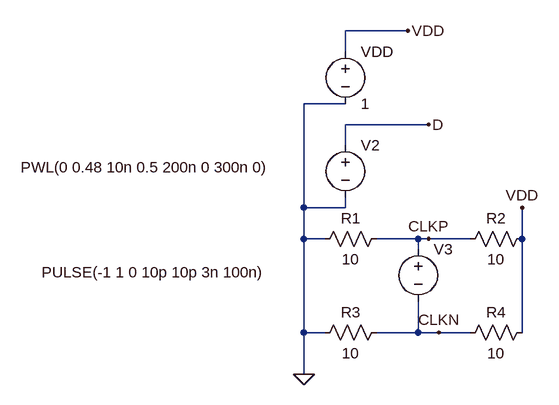
[diagram p0: schematic MetaS_ltspice_sim_2.asc]
MetaS_ltspice_sim_2.asc, the LTspice schematic file:
Version 4
SHEET 1 880 812
WIRE 0 0 -96 0
WIRE -96 32 -96 0
WIRE -96 112 -160 112
WIRE 32 144 -96 144
WIRE -96 176 -96 144
WIRE -160 272 -160 112
WIRE -96 272 -96 256
WIRE -96 272 -160 272
WIRE -160 320 -160 272
WIRE -128 320 -160 320
WIRE 16 320 -48 320
WIRE 32 320 16 320
WIRE 96 320 32 320
WIRE 176 320 176 272
WIRE 16 336 16 320
WIRE -160 464 -160 320
WIRE -128 464 -160 464
WIRE 16 464 16 416
WIRE 16 464 -48 464
WIRE 48 464 16 464
WIRE 96 464 48 464
WIRE 176 464 176 320
WIRE -160 528 -160 464
FLAG -160 528 0
FLAG 0 0 VDD
FLAG 32 144 D
FLAG 176 272 VDD
FLAG 32 320 CLKP
FLAG 48 464 CLKN
SYMBOL voltage -96 16 R0
WINDOW 123 0 0 Left 0
WINDOW 39 0 0 Left 0
SYMATTR InstName VDD
SYMATTR Value 1
SYMBOL voltage -96 160 R0
WINDOW 3 -500 50 Left 2
WINDOW 123 0 0 Left 0
WINDOW 39 0 0 Left 0
SYMATTR InstName V2
SYMATTR Value PWL(0 0.48 10n 0.5 200n 0 300n 0)
SYMBOL voltage 16 320 R0
WINDOW 3 -580 51 Left 2
WINDOW 123 0 0 Left 0
WINDOW 39 0 0 Left 0
SYMATTR InstName V3
SYMATTR Value PULSE(-1 1 0 10p 10p 3n 100n)
SYMBOL res -32 304 R90
WINDOW 0 0 56 VBottom 2
WINDOW 3 32 56 VTop 2
SYMATTR InstName R1
SYMATTR Value 10
SYMBOL res 192 304 R90
WINDOW 0 0 56 VBottom 2
WINDOW 3 32 56 VTop 2
SYMATTR InstName R2
SYMATTR Value 10
SYMBOL res -32 448 R90
WINDOW 0 0 56 VBottom 2
WINDOW 3 32 56 VTop 2
SYMATTR InstName R3
SYMATTR Value 10
SYMBOL res 192 448 R90
WINDOW 0 0 56 VBottom 2
WINDOW 3 32 56 VTop 2
SYMATTR InstName R4
SYMATTR Value 10

The netlist it stands for:
* MetaS_ltspice_sim_2.asc
VDD VDD 0 1
V2 D 0 PWL(0 0.48 10n 0.5 200n 0 300n 0)
V3 CLKP CLKN PULSE(-1 1 0 10p 10p 3n 100n)
R1 CLKP 0 10
R2 VDD CLKP 10
R3 CLKN 0 10
R4 VDD CLKN 10
.backanno
.end